# EAGLE design dspic33ch-revb (EAGLE 9.6.1)
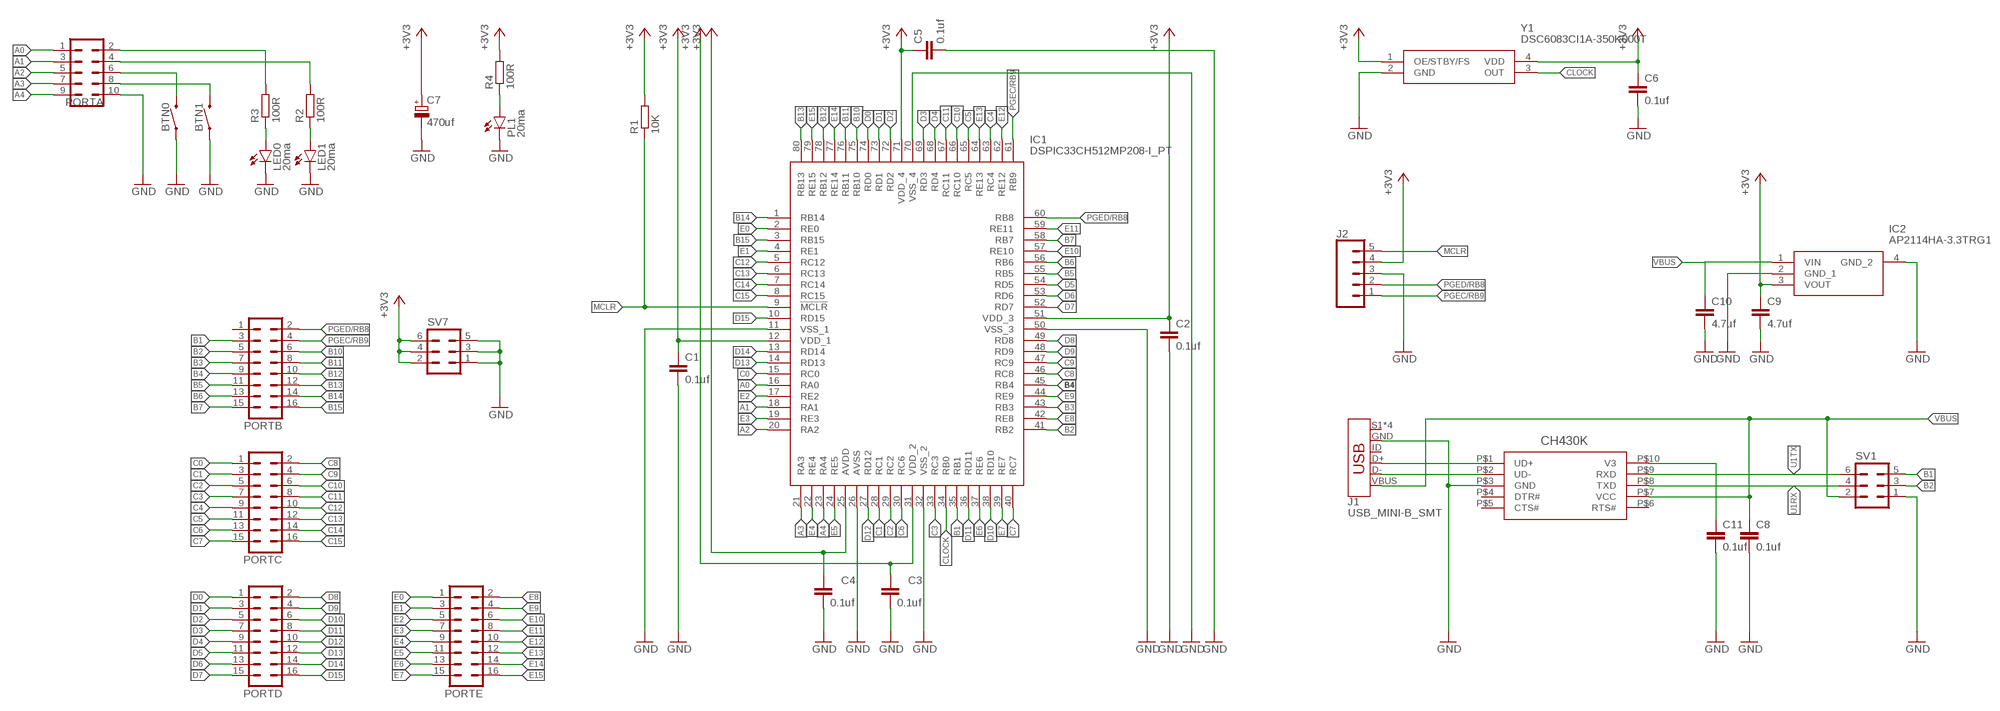
[diagram p0: schematic, sheet 1]

## Parts
BTN0  MOMENTARY-SWITCH-SPST-SMD-6.0X3.5MM  [TACTILE_SWITCH_SMD_6.0X3.5MM]
BTN1  MOMENTARY-SWITCH-SPST-SMD-6.0X3.5MM  [TACTILE_SWITCH_SMD_6.0X3.5MM]
C1  0.1uf  C-EUC0805  [C0805]
C2  0.1uf  C-EUC0805  [C0805]
C3  0.1uf  C-EUC0805  [C0805]
C4  0.1uf  C-EUC0805  [C0805]
C5  0.1uf  C-EUC0805  [C0805]
C6  0.1uf  C-EUC0805  [C0805]
C7  470uf  CPOL-EUE3.5-8  [E3,5-8]
C8  0.1uf  C-EUC0805  [C0805]
C9  4.7uf  C-EUC0805  [C0805]
C10  4.7uf  C-EUC0805  [C0805]
C11  0.1uf  C-EUC0805  [C0805]
IC1  DSPIC33CH512MP208-I_PT  [QFP50P1400X1400X120-80N]
IC2  AP2114HA-3.3TRG1  [SOT230P700X180-4N]
J1  USB_MINI-B_SMT  [USB-MINIB]
J2  CONN_05  [1X05]
LED0  20ma  LEDSML0805  [SML0805]
LED1  20ma  LEDSML0805  [SML0805]
PL1  20ma  LEDSML0805  [SML0805]
PORTA  MA05-2  [MA05-2]
PORTB  MA08-2  [MA08-2]
PORTC  MA08-2  [MA08-2]
PORTD  MA08-2  [MA08-2]
PORTE  MA08-2  [MA08-2]
R1  10K  R-EU_R0805  [R0805]
R2  100R  R-EU_R0805  [R0805]
R3  100R  R-EU_R0805  [R0805]
R4  100R  R-EU_R0805  [R0805]
SV1  MA03-2  [MA03-2]
SV7  MA03-2  [MA03-2]
U$1  CH430K  [ESSOP-10]
Y1  DSC6083CI1A-350K000T  [DSC6083CI1A350K000T]

## Nets
+3V3: C1.1 C2.1 C3.1 C4.1 C5.1 C6.1 C7.+ C9.1 IC1.12(VDD_1) IC1.25(AVDD) IC1.31(VDD_2) IC1.51(VDD_3) IC1.71(VDD_4) IC2.3(VOUT) J2.4 R1.2 R4.2 SV7.2 SV7.4 SV7.6 Y1.1(OE/STBY/FS) Y1.4(VDD)
A0: IC1.16(RA0) PORTA.1
A1: IC1.18(RA1) PORTA.3
A2: IC1.20(RA2) PORTA.5
A3: IC1.21(RA3) PORTA.7
A4: IC1.23(RA4) PORTA.9
B1: IC1.35(RB1) PORTB.3 SV1.5
B2: IC1.41(RB2) PORTB.5 SV1.3
B3: IC1.43(RB3) PORTB.7
B4: IC1.45(RB4) PORTB.9
B5: IC1.55(RB5) PORTB.11
B6: IC1.56(RB6) PORTB.13
B7: IC1.58(RB7) PORTB.15
B10: IC1.75(RB10) PORTB.6
B11: IC1.76(RB11) PORTB.8
B12: IC1.78(RB12) PORTB.10
B13: IC1.80(RB13) PORTB.12
B14: IC1.1(RB14) PORTB.14
B15: IC1.3(RB15) PORTB.16
C0: IC1.15(RC0) PORTC.1
C1: IC1.28(RC1) PORTC.3
C2: IC1.29(RC2) PORTC.5
C3: IC1.33(RC3) PORTC.7
C4: IC1.63(RC4) PORTC.9
C5: IC1.65(RC5) PORTC.11
C6: IC1.30(RC6) PORTC.13
C7: IC1.40(RC7) PORTC.15
C8: IC1.46(RC8) PORTC.2
C9: IC1.47(RC9) PORTC.4
C10: IC1.66(RC10) PORTC.6
C11: IC1.67(RC11) PORTC.8
C12: IC1.5(RC12) PORTC.10
C13: IC1.6(RC13) PORTC.12
C14: IC1.7(RC14) PORTC.14
C15: IC1.8(RC15) PORTC.16
CLOCK [logic]: IC1.34(RB0) Y1.3(OUT)
D0: IC1.74(RD0) PORTD.1
D1: IC1.73(RD1) PORTD.3
D2: IC1.72(RD2) PORTD.5
D3: IC1.69(RD3) PORTD.7
D4: IC1.68(RD4) PORTD.9
D5: IC1.54(RD5) PORTD.11
D6: IC1.53(RD6) PORTD.13
D7: IC1.52(RD7) PORTD.15
D8: IC1.49(RD8) PORTD.2
D9: IC1.48(RD9) PORTD.4
D10: IC1.38(RD10) PORTD.6
D11: IC1.36(RD11) PORTD.8
D12: IC1.27(RD12) PORTD.10
D13: IC1.14(RD13) PORTD.12
D14: IC1.13(RD14) PORTD.14
D15: IC1.10(RD15) PORTD.16
E0: IC1.2(RE0) PORTE.1
E1: IC1.4(RE1) PORTE.3
E2: IC1.17(RE2) PORTE.5
E3: IC1.19(RE3) PORTE.7
E4: IC1.22(RE4) PORTE.9
E5: IC1.24(RE5) PORTE.11
E6: IC1.37(RE6) PORTE.13
E7: IC1.39(RE7) PORTE.15
E8: IC1.42(RE8) PORTE.2
E9: IC1.44(RE9) PORTE.4
E10: IC1.57(RE10) PORTE.6
E11: IC1.59(RE11) PORTE.8
E12: IC1.62(RE12) PORTE.10
E13: IC1.64(RE13) PORTE.12
E14: IC1.77(RE14) PORTE.14
E15: IC1.79(RE15) PORTE.16
GND: BTN0.1 BTN1.1 C1.2 C2.2 C3.2 C4.2 C5.2 C6.2 C7.- C8.2 C9.2 C10.2 C11.2 IC1.11(VSS_1) IC1.26(AVSS) IC1.32(VSS_2) IC1.50(VSS_3) IC1.70(VSS_4) IC2.2(GND_1) IC2.4(GND_2) J1.GND J2.3 LED0.C LED1.C PL1.C PORTA.10 SV1.1 SV7.1 SV7.3 SV7.5 U$1.P$3(GND) Y1.2(GND)
MCLR [logic]: IC1.9(!MCLR) J2.5 R1.1
N$1 [logic]: LED1.A R2.1
N$2: PORTA.2 R3.2
N$3: PORTA.4 R2.2
N$4 [logic]: LED0.A R3.1
N$5: BTN0.2 PORTA.6
N$6 [logic]: PL1.A R4.1
N$8: BTN1.2 PORTA.8
N$9: C11.1 U$1.P$10(V3)
PGEC/RB9 [logic]: IC1.61(RB9) J2.1 PORTB.4
PGED/RB8 [logic]: IC1.60(RB8) J2.2 PORTB.2
U1RX: SV1.4 U$1.P$8(TXD)
U1TX: SV1.6 U$1.P$9(RXD)
USB_N: J1.D- U$1.P$2(UD-)
USB_P: J1.D+ U$1.P$1(UD+)
VBUS [power]: C8.1 C10.1 IC2.1(VIN) J1.VBUS SV1.2 U$1.P$7(VCC)
Unconnected: J1.ID J1.S1(SHIELD) J1.S2(SHIELD) J1.S3(SHIELD) J1.S4(SHIELD) PORTB.1 U$1.P$4(DTR#) U$1.P$5(CTS#) U$1.P$6(RTS#)

## Library data of the parts
BTN0 BTN1 = SparkFun-Switches:MOMENTARY-SWITCH-SPST: Momentary Switch (Pushbutton) - SPST Normally-open (NO) SPST momentary switches (buttons, pushbuttons). Variants PTH-12MM - 12mm square, through-hole Momentary Pushbutton Switch - 12mm Square <https://www.sparkfun.com/products/9190> (COM-09190) PTH-6.0MM, PTH-6.0MM-KIT - 6.0mm square, through-hole Mini Pushbutton Switch <https://www.sparkfun.com/products/97> (COM-00097) KIT package intended for soldering kit's - only one side of pads' copper is exposed. PTH-RIGHT-ANGLE-KIT - Right-angle, through-hole Right Angle Tactile Button <https://www.sparkfun.com/products/10791> - Used on SparkFun BigTime Watch Kit <https://www.sparkfun.com/products/11734> SMD-12MM - 12mm square, surface-mount Tactile Button - SMD (12mm) <https://www.sparkfun.com/products/12993> (COM-12993) Used on SparkFun PicoBoard <https://www.sparkfun.com/products/11888> SMD-4.5MM - 4.5mm Square Trackball Switch Used on SparkFun Blackberry Trackballer Breakout <https://www.sparkfun.com/products/13169> SMD-4.6MMX2.8MM - 4.60mm x 2.80mm, surface mount Used on SparkFun SAMD21 Mini Breakout <https://www.sparkfun.com/products/13664> SMD-5.2MM, SMD-5.2-REDUNDANT - 5.2mm square, surface-mount Mini Pushbutton Switch - SMD <https://www.sparkfun.com/products/8720> (COM-08720) Used on Arduino Pro Mini <https://www.sparkfun.com/products/11114> REDUNDANT package connects both switch circuits together SMD-6.0X3.5MM - 6.0 x 3.5mm, surface mount Momentary Reset Switch SMD <https://www.sparkfun.com/products/8229> (COM-08229) SMD-6.2MM-TALL - 6.2mm square, surface mount Tactile Button - SMD (6mm) <https://www.sparkfun.com/products/12992> Used on SparkFun Digital Sandbox <https://www.sparkfun.com/products/12651> SMD-RIGHT-ANGLE - Right-angle, surface mount Used on SparkFun Block for Intel® Edison - Arduino <https://www.sparkfun.com/products/13036>; PROD_ID: SWCH-14278; SF_SKU: COM-08229
C1-C6 C8-C11 = rcl:C-EU: CAPACITOR, European symbol; SPICEPREFIX: C
C7 = rcl:CPOL-EU: POLARIZED CAPACITOR, European symbol; SPICEPREFIX: C
IC1 = DSPIC33CH512MP208-I_PT:DSPIC33CH512MP208-I_PT: MCU 16-bit dsPIC RISC 512KB Flash 3.3V 80-Pin TQFP Tray Source: Datasheet <https://componentsearchengine.com/Datasheets/1/dsPIC33CH512MP208-I_PT.pdf>; ARROW_PART_NUMBER: DSPIC33CH512MP208-I/PT; ARROW_PRICE-STOCK: https://www.arrow.com/en/products/dspic33ch512mp208-ipt/microchip-technology; DESCRIPTION: MCU 16-bit dsPIC RISC 512KB Flash 3.3V 80-Pin TQFP Tray; HEIGHT: 1.2mm; MANUFACTURER_NAME: Microchip; MANUFACTURER_PART_NUMBER: DSPIC33CH512MP208-I/PT; MOUSER_PART_NUMBER: 579-33CH512MP208IPT; MOUSER_PRICE-STOCK: https://www.mouser.co.uk/ProductDetail/Microchip-Technology/dsPIC33CH512MP208-I-PT?qs=PqoDHHvF64%2FoRuzaf3bx2A%3D%3D
IC2 = AP2114HA-3.3TRG1:AP2114HA-3.3TRG1: Linear Voltage Regulator IC Positive Fixed 1 Output 1A SOT-223-3 Source: Datasheet <https://www.diodes.com//assets/Datasheets/AP2114.pdf>; ARROW_PART_NUMBER: AP2114HA-3.3TRG1; ARROW_PRICE-STOCK: https://www.arrow.com/en/products/ap2114ha-3.3trg1/diodes-incorporated?region=asia; DESCRIPTION: Linear Voltage Regulator IC Positive Fixed 1 Output 1A SOT-223-3; HEIGHT: 1.8mm; MANUFACTURER_NAME: Diodes Incorporated; MANUFACTURER_PART_NUMBER: AP2114HA-3.3TRG1; MOUSER_PART_NUMBER: 621-AP2114HA-3.3TRG1; MOUSER_PRICE-STOCK: https://www.mouser.co.uk/ProductDetail/Diodes-Incorporated/AP2114HA-3.3TRG1?qs=M%2FOdCRO8QQ3KWhA9Gt6VoQ%3D%3D
J1 = SparkFun-Connectors:USB_MINI-B: USB type Mini-B Connector Breaks out 5th pin, and includes shield pins if needed. SparkFun Products: SparkFun FTDI Basic Breakout <https://www.sparkfun.com/products/9716> SparkFun XBee Explorer USB <https://www.sparkfun.com/products/11812> SparkFun Redboard <https://www.sparkfun.com/products/12757>; PROD_ID: CONN-08193; SF_ID: PRT-00587
J2 = SparkFun-Connectors:CONN_05: Multi connection point. Often used as Generic Header-pin footprint for 0.1 inch spaced/style header connections On any of the 0.1 inch spaced packages, you can populate with these: Break Away Headers - Straight <https://www.sparkfun.com/products/116> (PRT-00116) Break Away Male Headers - Right Angle <https://www.sparkfun.com/products/553> (PRT-00553) Female Headers <https://www.sparkfun.com/products/115> (PRT-00115) Break Away Headers - Machine Pin <https://www.sparkfun.com/products/117> (PRT-00117) Break Away Female Headers - Swiss Machine Pin <https://www.sparkfun.com/products/743> (PRT-00743) For SCREWTERMINALS and SPRING TERMINALS visit here: Screw Terimnals on SparkFun.com <https://www.sparkfun.com/search/results?term=Screw+Terminals> (5mm/3.5mm/2.54mm spacing) This device is also useful as a general connection point to wire up your design to another part of your project. Our various solder wires solder well into these plated through hole pads. Hook-Up Wire - Assortment (Stranded, 22 AWG) <https://www.sparkfun.com/products/11375> (PRT-11375) Hook-Up Wire - Assortment (Solid Core, 22 AWG) <https://www.sparkfun.com/products/11367> (PRT-11367) View the entire wire category on our website here <https://www.sparkfun.com/categories/141> Special notes: Molex polarized connector foot print use with SKU : PRT-08231 with associated crimp pins and housings. 1MM SMD Version SKU: PRT-10208
LED0 LED1 PL1 = led:LED: LED OSRAM: - CHIPLED LG R971, LG N971, LY N971, LG Q971, LY Q971, LO R971, LY R971 LH N974, LH R974 LS Q976, LO Q976, LY Q976 LO Q996 - Hyper CHIPLED LW Q18S LB Q993, LB Q99A, LB R99A - SideLED LS A670, LO A670, LY A670, LG A670, LP A670 LB A673, LV A673, LT A673, LW A673 LH A674 LY A675 LS A676, LA A676, LO A676, LY A676, LW A676 LS A679, LY A679, LG A679 - Hyper Micro SIDELED® LS Y876, LA Y876, LO Y876, LY Y876 LT Y87S - SmartLED LW L88C, LW L88S LB L89C, LB L89S, LG L890 LS L89K, LO L89K, LY L89K LS L896, LA L896, LO L896, LY L896 - TOPLED LS T670, LO T670, LY T670, LG T670, LP T670 LSG T670, LSP T670, LSY T670, LOP T670, LYG T670 LG T671, LOG T671, LSG T671 LB T673, LV T673, LT T673, LW T673 LH T674 LS T676, LA T676, LO T676, LY T676, LB T676, LH T676, LSB T676, LW T676 LB T67C, LV T67C, LT T67C, LS T67K, LO T67K, LY T67K, LW E67C LS E67B, LA E67B, LO E67B, LY E67B, LB E67C, LV E67C, LT E67C LW T67C LS T679, LY T679, LG T679 LS T770, LO T770, LY T770, LG T770, LP T770 LB T773, LV T773, LT T773, LW T773 LH T774 LS E675, LA E675, LY E675, LS T675 LS T776, LA T776, LO T776, LY T776, LB T776 LHGB T686 LT T68C, LB T68C - Hyper Mini TOPLED® LB M676 - Mini TOPLED Santana® LG M470 LS M47K, LO M47K, LY M47K Source: http://www.osram.convergy.de LUXEON: - LUMILED® LXK2-PW12-R00, LXK2-PW12-S00, LXK2-PW14-U00, LXK2-PW14-V00 LXK2-PM12-R00, LXK2-PM12-S00, LXK2-PM14-U00 LXK2-PE12-Q00, LXK2-PE12-R00, LXK2-PE12-S00, LXK2-PE14-T00, LXK2-PE14-U00 LXK2-PB12-K00, LXK2-PB12-L00, LXK2-PB12-M00, LXK2-PB14-N00, LXK2-PB14-P00, LXK2-PB14-Q00 LXK2-PR12-L00, LXK2-PR12-M00, LXK2-PR14-Q00, LXK2-PR14-R00 LXK2-PD12-Q00, LXK2-PD12-R00, LXK2-PD12-S00 LXK2-PH12-R00, LXK2-PH12-S00 LXK2-PL12-P00, LXK2-PL12-Q00, LXK2-PL12-R00 Source: www.luxeon.com KINGBRIGHT: KA-3528ASYC Source: www.kingbright.com
PORTA = angelo-con-lstb:MA05-2: PIN HEADER; OC_FARNELL: unknown; OC_NEWARK: unknown
PORTB PORTC PORTD PORTE = angelo-con-lstb:MA08-2: PIN HEADER; OC_FARNELL: unknown; OC_NEWARK: unknown
R1-R4 = rcl:R-EU_: RESISTOR, European symbol; SPICEPREFIX: R
SV1 SV7 = con-lstb:MA03-2: PIN HEADER; OC_FARNELL: unknown; OC_NEWARK: unknown
U$1 = ch340k-nopad:CH430K: CH340K usb - uart
Y1 = angelo-DSC6083CI1A-350K000T:DSC6083CI1A-350K000T: Standard Clock Oscillators MEMS Oscillator, Ultra Low Power, LVCMOS, -40C-85C, 50ppm, 3.2x2.5mm Source: Datasheet <http://ww1.microchip.com/downloads/en/DeviceDoc/DSC60XX-Ultra-Small-Ultra-Low-Power-MEMS-Oscillator-DS20005625C.pdf>; ARROW_PART_NUMBER: DSC6083CI1A-350K000T; ARROW_PRICE-STOCK: https://www.arrow.com/en/products/dsc6083ci1a-350k000t/microchip-technology; DESCRIPTION: Standard Clock Oscillators MEMS Oscillator, Ultra Low Power, LVCMOS, -40C-85C, 50ppm, 3.2x2.5mm; HEIGHT: 0.9mm; MANUFACTURER_NAME: Microchip; MANUFACTURER_PART_NUMBER: DSC6083CI1A-350K000T; MOUSER_PART_NUMBER: 579-DSC6083CI1A350K; MOUSER_PRICE-STOCK: https://www.mouser.com/Search/Refine.aspx?Keyword=579-DSC6083CI1A350K

## Net classes
0 default: width 0.152 mm, drill 0.254 mm, clearance 0.203 mm
1 logic: width 0.152 mm, drill 0.254 mm, clearance 0.152 mm
2 power: width 0.406 mm, drill 0.254 mm, clearance 0.203 mm

## Board
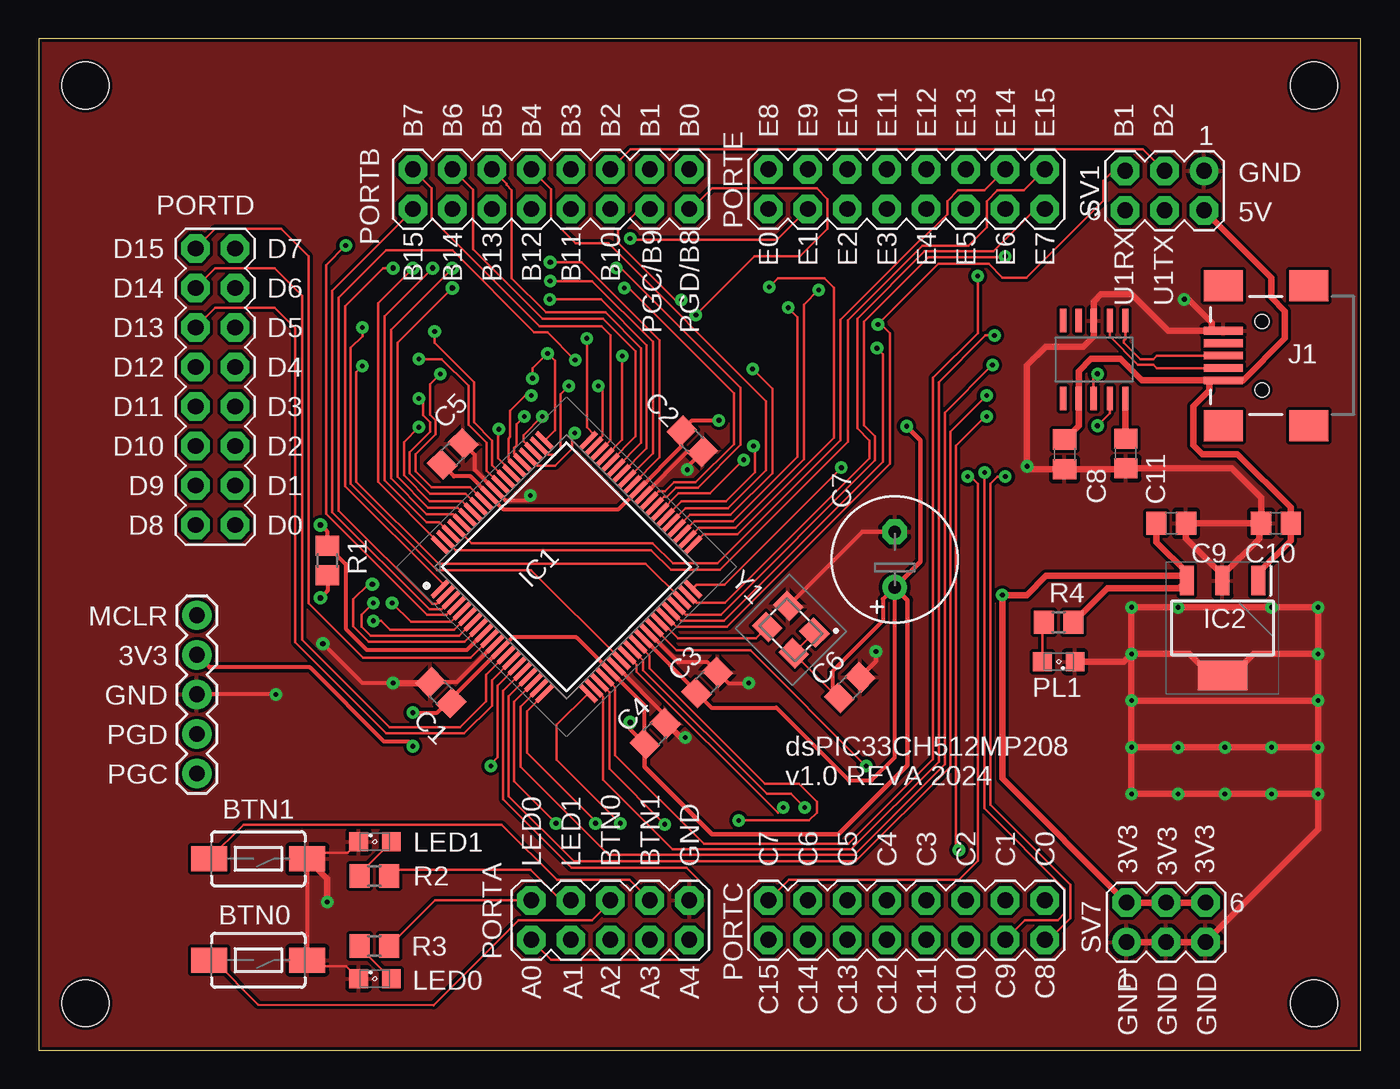
[diagram p1: board, top side]
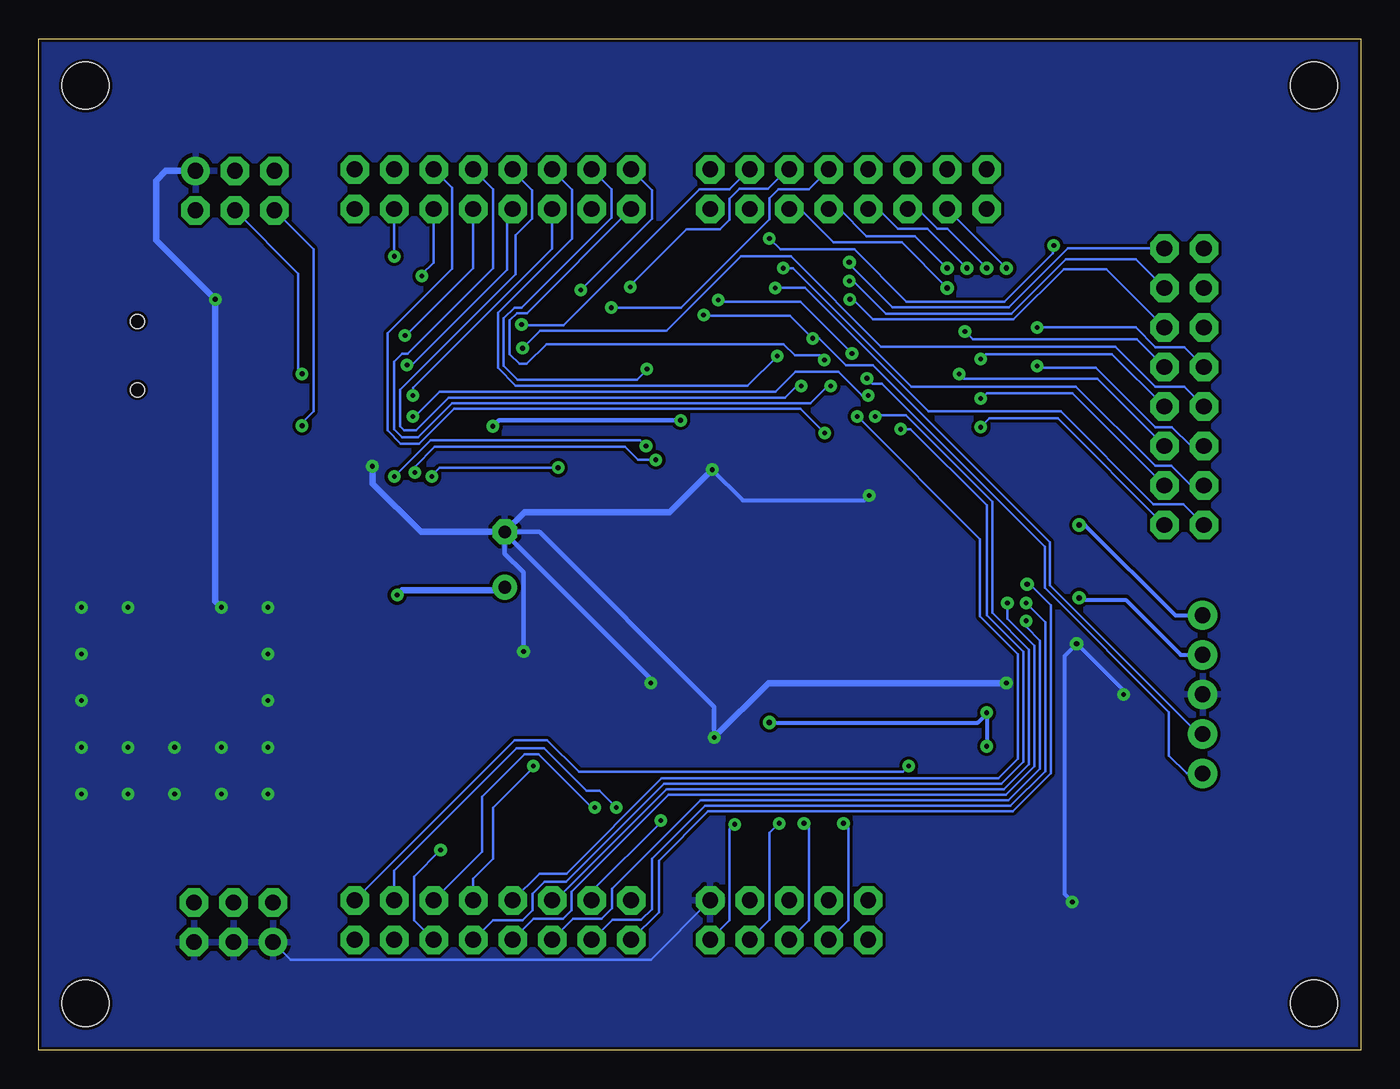
[diagram p2: board, bottom side, seen from below]

Size 85 x 65 mm. Coordinates in mm from the lower left corner, seen from the top.
Outline: 0,0 85,0 85,65 0,65 0,0
Copper layers (1*16): Top 0.035mm / dielectric 1.6mm / Bottom 0.035mm
Design rules "angelo-jlcpcb-2layers *": minimum track width 6mil, minimum drill 0.3mm, track to track 6mil, track to pad 6mil, pad to pad 6mil, via to via 10mil, smd to smd 6mil, copper to edge 0.2mm, drill to drill 8mil, minimum pad ring 10mil, minimum via ring 10mil, stop-mask expansion 4mil, vias tented up to drill 0mil, thermal gap 10mil
Holes 3 mm at 3,3 3,62 82,3 82,62

### Footprints (pad centres in the part's own frame; a part is rotated, then mirrored left to right if it is on the bottom)
TACTILE_SWITCH_SMD_6.0X3.5MM = smd 2.3 x 1.6: 1 -3.15,0; 2 3.15,0
C0805 = smd 1.3 x 1.5: 1 -0.95,0; 2 0.95,0
E3,5-8 = drill 0.813 pad 1.6: + -1.778,0 | drill 0.813 pad 1.6 octagon: - 1.778,0
QFP50P1400X1400X120-80N = smd 1.475 x 0.3: 1 -6.738,4.75; 2 -6.738,4.25; 3 -6.738,3.75; 4 -6.738,3.25; 5 -6.738,2.75; 6 -6.738,2.25; 7 -6.738,1.75; 8 -6.738,1.25; 9 -6.738,0.75; 10 -6.738,0.25; 11 -6.738,-0.25; 12 -6.738,-0.75; 13 -6.738,-1.25; 14 -6.738,-1.75; 15 -6.738,-2.25; 16 -6.738,-2.75; 17 -6.738,-3.25; 18 -6.738,-3.75; 19 -6.738,-4.25; 20 -6.738,-4.75; 41 6.738,-4.75; 42 6.738,-4.25; 43 6.738,-3.75; 44 6.738,-3.25; 45 6.738,-2.75; 46 6.738,-2.25; 47 6.738,-1.75; 48 6.738,-1.25; 49 6.738,-0.75; 50 6.738,-0.25; 51 6.738,0.25; 52 6.738,0.75; 53 6.738,1.25; 54 6.738,1.75; 55 6.738,2.25; 56 6.738,2.75; 57 6.738,3.25; 58 6.738,3.75; 59 6.738,4.25; 60 6.738,4.75 | smd 0.3 x 1.475: 21 -4.75,-6.738; 22 -4.25,-6.738; 23 -3.75,-6.738; 24 -3.25,-6.738; 25 -2.75,-6.738; 26 -2.25,-6.738; 27 -1.75,-6.738; 28 -1.25,-6.738; 29 -0.75,-6.738; 30 -0.25,-6.738; 31 0.25,-6.738; 32 0.75,-6.738; 33 1.25,-6.738; 34 1.75,-6.738; 35 2.25,-6.738; 36 2.75,-6.738; 37 3.25,-6.738; 38 3.75,-6.738; 39 4.25,-6.738; 40 4.75,-6.738; 61 4.75,6.738; 62 4.25,6.738; 63 3.75,6.738; 64 3.25,6.738; 65 2.75,6.738; 66 2.25,6.738; 67 1.75,6.738; 68 1.25,6.738; 69 0.75,6.738; 70 0.25,6.738; 71 -0.25,6.738; 72 -0.75,6.738; 73 -1.25,6.738; 74 -1.75,6.738; 75 -2.25,6.738; 76 -2.75,6.738; 77 -3.25,6.738; 78 -3.75,6.738; 79 -4.25,6.738; 80 -4.75,6.738
SOT230P700X180-4N = smd 1.9 x 0.9: 1 -3.05,2.3; 2 -3.05,0; 3 -3.05,-2.3 | smd 1.9 x 3.2: 4 3.05,0
USB-MINIB = smd 2.5 x 0.5: D+ 2.5,0; D- 2.5,0.8; GND 2.5,-1.6; ID 2.5,-0.8; VBUS 2.5,1.6 | smd 2.5 x 2: S1 -3,4.5; S2 2.5,4.5; S3 -3,-4.5; S4 2.5,-4.5 | hole 0.9: 0,2.2; 0,-2.2
1X05 = drill 1.016 pad 1.88: 1 0,0; 2 2.54,0; 3 5.08,0; 4 7.62,0; 5 10.16,0
SML0805 = smd 1.2 x 1.2: A 1.05,0; C -1.05,0
MA05-2 = drill 1.016 octagon: 1 -5.08,-1.27; 2 -5.08,1.27; 3 -2.54,-1.27; 4 -2.54,1.27; 5 0,-1.27; 6 0,1.27; 7 2.54,-1.27; 8 2.54,1.27; 9 5.08,-1.27; 10 5.08,1.27
MA08-2 = drill 1.016 octagon: 1 -8.89,-1.27; 2 -8.89,1.27; 3 -6.35,-1.27; 4 -6.35,1.27; 5 -3.81,-1.27; 6 -3.81,1.27; 7 -1.27,-1.27; 8 -1.27,1.27; 9 1.27,-1.27; 10 1.27,1.27; 11 3.81,-1.27; 12 3.81,1.27; 13 6.35,-1.27; 14 6.35,1.27; 15 8.89,-1.27; 16 8.89,1.27
R0805 = smd 1.3 x 1.5: 1 -0.95,0; 2 0.95,0
MA03-2 = drill 1.016: 1 -2.54,-1.27 | drill 1.016 octagon: 2 -2.54,1.27; 3 0,-1.27; 4 0,1.27; 5 2.54,-1.27; 6 2.54,1.27
ESSOP-10 = smd 1.5 x 0.4: P$1 -2.5,2; P$2 -2.5,1; P$3 -2.5,-0.032; P$4 -2.5,-1; P$5 -2.5,-2; P$6 2.5,-2; P$7 2.5,-1; P$8 2.5,-0.032; P$9 2.5,1; P$10 2.5,2
DSC6083CI1A350K000T = smd 1.5 x 1.3: 1 1.2,0.95; 2 -1.2,0.95; 3 -1.2,-0.95; 4 1.2,-0.95

### Placement (x,y rotation side)
BTN0  14.11,5.77 180 top
BTN1  14.11,12.29 180 top
C1  25.85,22.97 135 top
C2  42.01,39.14 315 top
C3  42.97,23.62 45 top
C4  39.63,20.34 45 top
C5  26.61,38.31 45 top
C6  52.14,23.3 45 top
C7  55.04,31.53 90 top
C8  65.96,38.29 270 top
C9  72.82,33.86 0 top
C10  79.55,33.86 180 top
C11  69.9,38.35 270 top
IC1  33.93,31.06 45 top
IC2  76.12,27.13 270 top
J1  78.66,44.64 180 top
J2  10.16,17.78 90 top
LED0  21.61,4.58 0 top
LED1  21.61,13.39 0 top
PL1  65.58,24.95 180 top
PORTA  36.75,8.35 0 top
PORTB  32.94,55.34 180 top
PORTC  55.8,8.35 180 top
PORTD  11.35,42.64 90 top
PORTE  55.8,55.34 0 top
R1  18.56,31.46 270 top
R2  21.58,11.19 0 top
R3  21.58,6.68 0 top
R4  65.58,27.5 0 top
SV1  72.39,55.24 180 top
SV7  72.48,8.21 0 top
U$1  67.86,44.39 270 top
Y1  48.36,27.02 315 top

### Tracks (layer width: path | path; a pad name or v marks a point on that pad's centre or on a via)
+3V3  (via drill 0.3 pad 0.6, 0.35)
  Top 0.152: C6.1 51.41,22.63 Y1.4 Y1.1 | 18.11,29.09 v18.11,29.07
  Top 0.254: C5.1 26.7,36.88 27.75,36.88 IC1.71 29.86,34.77 37.28,34.77 IC1.51 41.34,38.82 C2.1 42.01,40.48 v43.73,40.48 | 26.52,22.59 IC1.12 30.46,26.52 34.57,26.52 IC1.25 38.91,22.19 38.91,19.73 C4.1 38.02,20.61 v38.02,21.05 | 26.52,22.59 C1.1 | IC1.31 42.3,23.04 C3.1 43.24,22 47.42,22 52.09,17.34 53.55,17.34 55.04,18.83 C7.+ 54.28,28.99 54.28,27.59 51.04,24.35 51.04,23.06 | v24.05,21.68 25.62,21.68 26.52,22.59 | v24.05,19.53 23.73,19.84 22.18,19.84 17.43,24.59 10.97,24.59 J2.4 | R1.2 18.55,29.52 18.11,29.09
  Top 0.305: C4.1 38.96,18.2 43.29,13.87 51.42,13.87 55.86,18.32 55.86,28.92 C7.+ 56.69,31.4 56.69,39.21 v55.8,40.1 | 51.04,23.06 C6.1
  Top 0.406: C9.1 71.87,32.65 73.82,30.7 IC2.3 | IC2.3 73.31,29.67 68.71,29.67 R4.2 | IC2.3 73.52,30.48 64.77,30.48 63.53,29.24 v61.96,29.24 61.96,17.46 SV7.2 SV7.4 SV7.6
  Bottom 0.152: v18.11,29.07 17.98,28.94
  Bottom 0.254: v24.05,21.68 24.05,21.62 | 24.05,21.62 v24.05,19.53 | v38.02,21.05 24.62,21.05 24.05,21.62 | 17.98,28.94 15.11,28.94 11.57,25.4 J2.4
  Bottom 0.305: v43.73,40.48 55.42,40.48 v55.8,40.1
  Bottom 0.406: C7.+ 55.23,29.56 61.64,29.56 v61.96,29.24
A0
  Top 0.152: IC1.16 29.84,23.08 29.84,16.11 34.24,11.72 41.64,11.72 43.1,10.26 43.1,6.45 42.47,5.81 32.94,5.81 PORTA.1
A1  (via drill 0.3 pad 0.6)
  Top 0.152: IC1.18 30.55,22.38 30.55,17.28 v33.26,14.57
  Bottom 0.152: v33.26,14.57 32.95,14.27 32.95,8.36 32.95,8.34 PORTA.3
A2  (via drill 0.3 pad 0.6)
  Top 0.152: IC1.20 31.38,21.79 31.38,19.12 35.86,14.64 v35.8,14.57
  Bottom 0.152: v35.8,14.57 35.49,14.27 35.49,8.34 PORTA.5
A3  (via drill 0.3 pad 0.6)
  Top 0.152: IC1.21 33.3,20.9 33.3,18.66 v37.38,14.57
  Bottom 0.152: v37.38,14.57 38.01,13.95 38.01,8.36 PORTA.7
A4  (via drill 0.3 pad 0.6)
  Top 0.152: IC1.23 36.69,22.99 36.69,18.07 v40.24,14.51
  Bottom 0.152: v40.24,14.51 40.57,14.18 40.57,8.34 PORTA.9
B1  (via drill 0.3 pad 0.6)
  Top 0.152: IC1.35 40.35,27.88 41.02,27.21 44.24,27.21 54.72,37.69 54.72,46.07 54.15,46.64 v53.96,46.64 57.86,50.55 61.09,50.55 61.98,49.66 63.5,49.66 68.45,54.61 68.45,55.88 69.09,56.52 SV1.5
  Bottom 0.152: v53.96,46.64 53.91,46.59 51.25,46.59 42.52,55.33 40.57,55.33 PORTB.3
B2  (via drill 0.3 pad 0.6)
  Top 0.152: IC1.41 42.75,33.16 44.94,33.16 51.14,39.36 51.14,48.99 50.53,49.6 47.52,49.6 v46.97,49.05 | PORTB.5 38.05,57.91 70.99,57.91 SV1.3
  Bottom 0.152: v46.97,49.05 46.97,49.12 43.34,52.75 41.21,52.75 40.57,53.38 40.57,54.73 39.95,55.35 38.1,55.35 36.84,56.61 PORTB.5
B3  (via drill 0.3 pad 0.6)
  Top 0.152: IC1.43 42.17,33.99 44.64,33.99 48.79,38.14 48.79,47.11 v48.18,47.72
  Bottom 0.152: v48.18,47.72 43.7,47.72 38.01,53.41 38.01,54.76 37.44,55.33 35.49,55.33 PORTB.7
B4
  Top 0.152: IC1.45 41.59,34.83 44.32,34.83 46.76,37.27 46.76,41.71 36.62,51.85 34.53,51.85 32.94,53.44 32.94,55.34 PORTB.9
B5
  Top 0.152: IC1.55 38.73,39.04 38.73,45.12 36.44,47.41 32.61,47.41 30.41,49.61 30.41,55.27 30.07,55.62 30.07,55.67 PORTB.11
B6
  Top 0.152: IC1.56 36.75,37.83 38.38,39.46 38.38,44.91 36.29,46.99 32.39,46.99 27.91,51.47 27.91,55.29 PORTB.13
B7
  Top 0.152: IC1.58 36.77,39.2 36.77,45.95 36.18,46.54 32.21,46.54 25.27,53.48 25.27,55.39 PORTB.15
B10  (via drill 0.35)
  Top 0.152: IC1.75 26.94,34.86 25.03,34.86 23.06,36.84 23.06,45.46 v26.59,48.99
  Bottom 0.152: v26.59,48.99 29.51,51.91 33.9,51.91 36.06,54.07 PORTB.6
B11  (via drill 0.35)
  Top 0.152: IC1.76 26.65,34.45 24.93,34.45 22.64,36.74 22.64,46.31 v26.59,50.26
  Bottom 0.152: v26.59,50.26 28.65,52.32 31.77,52.32 33.52,54.07 PORTB.8
B12  (via drill 0.35)
  Top 0.152: IC1.78 25.75,33.93 24.93,33.93 22.22,36.63 22.22,47.16 v25.32,50.26
  Bottom 0.152: v25.32,50.26 27.85,52.79 29.76,52.79 31.05,54.07 PORTB.10
B13  (via drill 0.35)
  Top 0.152: IC1.80 25.8,32.53 21.8,36.53 21.8,48.01 v24.05,50.26
  Bottom 0.152: v24.05,50.26 26.58,52.79 27.22,52.79 28.5,54.07 PORTB.12
B14  (via drill 0.35)
  Top 0.152: v22.78,50.26 22.14,50.26 19.71,47.82 19.71,36.25 25.95,30.01 25.95,29.79 IC1.1
  Bottom 0.152: PORTB.14 v22.78,50.26
B15
  Top 0.152: IC1.3 25.89,28.32 25.13,28.32 18.87,34.58 18.87,48.83 24.05,54.01 PORTB.16
C0  (via drill 0.3 pad 0.6)
  Top 0.152: IC1.15 29.49,23.43 29.49,18.81 29.07,18.39 v29.07,18.26
  Bottom 0.152: v29.07,18.26 29.45,17.88 50.28,17.88 52.31,19.91 54.4,19.91 PORTC.1
C1  (via drill 0.3 pad 0.6)
  Top 0.152: v47.86,15.59 47.52,15.25 38.44,24.33 38.44,24.77 IC1.28
  Bottom 0.152: v47.86,15.59 48.94,16.67 49.77,16.67 52.5,19.4 54.28,19.4 62.15,11.53 PORTC.3
C2  (via drill 0.3 pad 0.6)
  Top 0.152: v49.26,15.59 48.37,16.48 46.81,16.48 38.86,24.43 38.86,25.06 IC1.29
  Bottom 0.152: v49.26,15.59 49.43,15.59 52.86,19.02 53.77,19.02 56.5,16.29 56.5,12.73 PORTC.5
C3  (via drill 0.3 pad 0.6)
  Top 0.152: IC1.33 39.58,27.11 41,25.69 45.77,25.69 v53.2,18.26
  Bottom 0.152: v53.2,18.26 53.2,18.19 55.8,15.59 55.8,12.29 57.07,11.02 PORTC.7
C4  (via drill 0.3 pad 0.6)
  Top 0.152: v32.37,40.73 31.16,39.53 31.16,39.13 IC1.63
  Bottom 0.152: v32.37,40.73 24.47,32.84 24.47,27.87 22.05,25.45 22.05,18.73 23.31,17.47 44.95,17.47 51.08,11.34 52.82,11.34 PORTC.9
C5  (via drill 0.3 pad 0.6)
  Top 0.152: v31.23,40.73 30.73,40.24 30.73,38.89 30.55,38.71 30.55,38.32 IC1.65
  Bottom 0.152: v31.23,40.73 31.16,40.8 29.26,40.8 23.69,35.24 23.69,28.1 21.34,25.74 21.34,18.37 22.95,16.76 44.65,16.76 51.79,9.62 PORTC.11
C6  (via drill 0.3 pad 0.6)
  Top 0.152: IC1.30 39.28,25.35 39.28,24.53 46.69,17.11 48.88,17.11 50.02,15.97 50.02,15.25 49.53,14.76 v45.01,14.76
  Bottom 0.152: v45.01,14.76 45.01,14.64 49.45,10.19 PORTC.13
C7  (via drill 0.3 pad 0.6)
  Top 0.152: IC1.40 42.31,29.9 44.08,29.9 v51.61,37.43 | v59.74,36.86 59.93,36.86 60.37,36.42 60.37,12.16 59.17,10.95 48.24,10.95 PORTC.15
  Bottom 0.152: v51.61,37.43 59.23,37.43 59.77,36.89 v59.74,36.86
C8  (via drill 0.3 pad 0.6)
  Top 0.152: IC1.46 41.33,35.27 44.18,35.27 46.06,37.15 46.06,38.73 v45.96,38.83 | v62.15,36.86 61.64,36.86 61.2,36.42 61.2,15.78 66.34,10.64 66.34,8.48 64.94,7.08 PORTC.2
  Bottom 0.152: v62.15,36.86 59.8,39.21 46.34,39.21 v45.96,38.83
C9  (via drill 0.3 pad 0.6)
  Top 0.152: IC1.47 41.13,35.78 43.16,35.78 45.26,37.88 45.26,37.94 v45.32,37.94 | v60.82,37.12 60.82,15.53 65.96,10.38 65.96,8.79 65.52,8.35 63.42,8.35 PORTC.4
  Bottom 0.152: v45.32,37.94 46.47,37.94 47.29,38.77 59.55,38.77 60.82,37.5 v60.82,37.12
C10  (via drill 0.3 pad 0.6)
  Top 0.152: v60.94,40.73 60.88,40.73 58.98,38.83 58.98,13.05 v59.17,12.86 | v31.67,42.08 31.31,42.08 30.31,41.08 30.31,39.41 30.2,39.31 30.2,37.97 IC1.66
  Bottom 0.152: v60.94,40.73 60.82,40.73 59.23,42.32 37.64,42.32 36.35,43.61 33.6,43.61 32.07,42.08 v31.67,42.08 | v59.17,12.86 60.88,11.14 60.88,8.35 PORTC.6
C11  (via drill 0.3 pad 0.6)
  Top 0.152: IC1.67 30.4,37.16 29.53,38.03 29.53,39.87 v29.57,39.91
  Bottom 0.152: v29.57,39.91 28.94,39.91 24.05,35.02 24.05,27.95 21.69,25.59 21.69,18.52 23.1,17.11 44.8,17.11 51.1,10.81 52.48,10.81 53.25,10.05 53.25,9 53.9,8.35 55.8,8.35 PORTC.8
C12  (via drill 0.3 pad 0.6)
  Top 0.152: IC1.5 26.51,27.53 23.92,27.53 v22.72,28.73
  Bottom 0.152: v22.72,28.73 22.72,27.71 20.98,25.98 20.98,18.23 22.8,16.4 44.5,16.4 50.73,10.17 50.73,9 51.3,8.43 53.18,8.43 PORTC.10
C13  (via drill 0.3 pad 0.6)
  Top 0.152: IC1.6 26.71,27.02 22.59,27.02 22.02,27.59 v21.51,27.59
  Bottom 0.152: v21.51,27.59 21.51,27.21 20.62,26.32 20.62,18.08 22.66,16.05 42.45,16.05 48.13,10.37 48.13,9.13 48.83,8.43 50.64,8.43 PORTC.12
C14  (via drill 0.3 pad 0.6)
  Top 0.152: IC1.7 27.04,26.64 21.32,26.64 20.75,27.21 20.75,27.97 v21.51,28.73
  Bottom 0.152: v21.51,28.73 20.27,27.49 20.27,17.93 22.51,15.69 42.17,15.69 45.58,12.29 45.58,9.05 46.26,8.36 48.1,8.36 49.39,7.08 PORTC.14
C15  (via drill 0.35)
  Top 0.152: IC1.8 27.36,26.26 21.2,26.26 20.21,27.24 20.21,28.96 21.19,29.94 v21.45,29.94
  Bottom 0.152: v21.45,29.94 21.26,29.94 19.91,28.6 19.91,17.78 22.36,15.34 41.96,15.34 45.13,12.16 45.13,8.86 PORTC.16
CLOCK
  Top 0.152: IC1.34 40.03,27.53 41.09,26.47 46.11,26.47 Y1.3
D0  (via drill 0.3)
  Top 0.152: IC1.74 27.23,35.28 25.13,35.28 23.48,36.94 23.48,39.08 v24.43,40.04
  Bottom 0.152: v24.43,40.04 23.86,40.61 19.48,40.61 PORTD.1
D1  (via drill 0.3)
  Top 0.152: IC1.73 27.45,35.76 25.17,35.76 23.85,37.08 23.85,38.41 25.16,39.73 25.16,40.34 24.71,40.8 24.71,41.6 v24.43,41.88
  Bottom 0.152: v24.43,41.88 24.37,41.88 24.03,42.22 18.55,42.22 PORTD.3
D2  (via drill 0.3)
  Top 0.152: v25.83,43.47 25.16,42.8 25.16,40.84 25.52,40.49 25.52,39.59 24.24,38.3 24.24,37.21 25.27,36.18 27.74,36.18 IC1.72
  Bottom 0.152: v25.83,43.47 25.51,43.15 16.94,43.15 PORTD.5
D3  (via drill 0.3)
  Top 0.152: IC1.69 28.8,37.24 28.8,39.03 27.63,40.2 27.63,42.7 25.91,44.42 v24.43,44.42
  Bottom 0.152: v24.43,44.42 24.11,44.74 15.99,44.74 PORTD.7
D4  (via drill 0.3)
  Top 0.152: v25.45,46.2 25.45,45.46 27.99,42.92 27.99,40.35 29.16,39.18 29.16,37.59 IC1.68
  Bottom 0.152: v25.45,46.2 24.94,45.69 14.4,45.69 PORTD.9
D5  (via drill 0.3 pad 0.6)
  Top 0.152: IC1.54 39.09,38.69 39.09,45.32 36.15,48.26 v32.84,48.26
  Bottom 0.152: v32.84,48.26 32.75,48.35 31.36,46.97 22.32,46.97 19.1,50.2 16.37,50.2 PORTD.11
D6  (via drill 0.3 pad 0.6)
  Top 0.152: IC1.53 39.48,38.38 39.48,45.52 35.56,49.43 v32.88,49.43
  Bottom 0.152: v32.88,49.43 32.62,49.43 30.53,47.34 22.46,47.34 18.97,50.83 14.46,50.83 PORTD.13
D7  (via drill 0.35)
  Top 0.152: IC1.52 39.92,38.11 39.92,45.62 34.91,50.64 v32.88,50.64
  Bottom 0.152: v32.88,50.64 32.88,50.51 30.11,47.74 22.62,47.74 18.84,51.53 PORTD.15
D8  (via drill 0.3 pad 0.6)
  Top 0.152: IC1.49 39.84,35.91 40.25,35.91 40.84,36.49 42.22,36.49 44.69,38.96 44.69,42.22 37.92,48.99 v37.64,48.99
  Bottom 0.152: v37.64,48.99 35.74,48.99 27.81,41.05 19.29,41.05 13.32,35.08 11.41,35.08 PORTD.2
D9  (via drill 0.3 pad 0.6)
  Top 0.152: IC1.48 40.19,35.55 40.4,35.55 40.98,36.14 42.38,36.14 45.13,38.89 45.13,42.58 37.38,50.32 37.19,50.32 v37.13,50.26
  Bottom 0.152: v37.13,50.26 36.5,50.26 28.88,42.64 18.31,42.64 13.22,37.55 12.19,37.55 10.93,36.29 PORTD.4
D10  (via drill 0.3 pad 0.6)
  Top 0.152: IC1.38 39.01,31.27 25.69,31.27 20.42,36.55 20.42,43.58 v20.81,43.97
  Bottom 0.152: v20.81,43.97 20.68,43.85 17.04,43.85 13.22,40.02 12.13,40.02 10.93,38.83 PORTD.6
D11  (via drill 0.3 pad 0.6)
  Top 0.152: IC1.36 41.28,27.59 44.05,27.59 54.28,37.81 54.28,44.74 v53.9,45.12
  Bottom 0.152: v53.9,45.12 52.78,46.23 44.63,46.23 39.85,51.02 36.65,51.02 30.84,45.22 15.77,45.22 13.19,42.64 11.35,42.64 PORTD.8
D12  (via drill 0.3 pad 0.6)
  Top 0.152: v20.81,46.45 20.81,45.88 20.06,45.13 20.06,36.4 25.61,30.85 31.66,30.85 IC1.27
  Bottom 0.152: v20.81,46.45 14.46,46.45 13.19,45.18 11.35,45.18 PORTD.10
D13
  Top 0.152: IC1.14 29.13,23.78 29.13,22.13 27.35,20.35 22.34,20.35 16.49,26.2 16.49,46.39 15.16,47.72 11.35,47.72 PORTD.12
D14
  Top 0.152: IC1.13 30.05,25.39 28.77,24.12 28.77,22.41 27.1,20.73 22.57,20.73 16.93,26.37 16.93,48.49 15.16,50.26 11.35,50.26 PORTD.14
D15
  Top 0.152: IC1.10 28.99,26.44 27.75,25.2 20.85,25.2 17.35,28.71 17.35,51.03 15.58,52.8 11.35,52.8 PORTD.16
E0  (via drill 0.3 pad 0.6)
  Top 0.152: IC1.2 26.16,29.27 25.57,28.68 25.27,28.68 19.29,34.67 19.29,48.35 22.34,51.4 26.59,51.4 31.86,46.13 32.7,46.13 v34.48,44.35
  Bottom 0.152: v34.48,44.35 34.78,44.65 36.38,44.65 37.11,45.38 52.36,45.38 53.64,44.1 54.09,44.1 54.72,44.74 54.72,46.92 54.26,47.38 53.6,47.38 PORTE.1
E1  (via drill 0.3 pad 0.6)
  Top 0.152: IC1.4 26.68,28.4 26.64,28.4 26.21,27.97 24.98,27.97 18.46,34.49 18.46,50.45 v19.73,51.72 | v38.02,52.16 38.02,52.1 47.48,52.1 PORTE.3
  Bottom 0.152: v19.73,51.72 19.8,51.66 19.8,51.21 22.91,48.1 29.19,48.1 32.56,51.46 37.32,51.46 v38.02,52.16
E2  (via drill 0.3 pad 0.6)
  Top 0.152: IC1.17 30.2,22.73 30.2,16.33 34.4,12.12 52.52,12.12 58.62,18.22 58.62,39.74 v60.94,42.07
  Bottom 0.152: v60.94,42.07 60.94,42.56 51.99,51.51 PORTE.5
E3  (via drill 0.3 pad 0.6)
  Top 0.152: IC1.19 30.96,22.08 30.96,18.2 36.62,12.54 52.43,12.54 58.26,18.37 58.26,40.98 v61.33,44.04
  Bottom 0.152: v61.33,44.04 61.01,44.04 54.89,50.16 54.89,53.71 PORTE.7
E4  (via drill 0.3 pad 0.6)
  Top 0.152: IC1.22 36.27,22.7 36.27,17.38 40.75,12.9 52.22,12.9 57.87,18.54 57.87,36.12 57.87,42.93 60.88,45.94 v61.45,45.94
  Bottom 0.152: v61.45,45.94 61.39,45.94 57.07,50.26 PORTE.9
E5  (via drill 0.3 pad 0.6)
  Top 0.152: IC1.24 37.07,23.32 37.07,18.95 42.77,13.25 52.08,13.25 57.5,18.68 57.5,43.23 60.37,46.09 v60.37,49.75
  Bottom 0.152: v60.37,49.75 60.37,49.86 59.61,50.62 PORTE.11
E6  (via drill 0.3 pad 0.6)
  Top 0.152: IC1.37 40.99,28.56 41.58,27.97 43.85,27.97 53.78,37.9 53.78,39.44 53.05,40.18 53.05,46.81 57.2,50.96 62.02,50.96 62.09,51.02 v62.15,51.02
  Bottom 0.152: v62.15,51.02 PORTE.13
E7
  Top 0.152: IC1.39 41.73,29.3 42.29,28.74 44.12,28.74 53.42,38.05 53.42,39.17 52.63,39.97 52.63,47.01 56.95,51.34 61.39,51.34 64.12,54.07 PORTE.15
E8  (via drill 0.3 pad 0.6)
  Top 0.152: IC1.42 42.46,33.58 44.79,33.58 49.2,37.98 49.2,47.91 v50.15,48.86
  Bottom 0.152: v50.15,48.86 45.58,53.44 45.58,55.28 PORTE.2
E9  (via drill 0.3 pad 0.6)
  Top 0.152: IC1.44 41.88,34.41 44.48,34.41 47.16,37.09 47.16,42.51 v45.89,43.78
  Bottom 0.152: v45.89,43.78 45.89,43.72 46.53,43.08 54.21,43.08 55.1,43.97 55.1,47.04 54.41,47.73 53.95,47.73 48.18,53.5 48.18,55.34 PORTE.4
E10  (via drill 0.3 pad 0.6)
  Top 0.152: IC1.57 37.51,39.24 v37.51,44.61
  Bottom 0.152: v37.51,44.61 39.42,42.7 54.34,42.7 55.48,43.85 55.48,47.4 50.72,52.16 50.72,55.31 51.99,56.58 PORTE.6
E11  (via drill 0.3 pad 0.6)
  Top 0.152: IC1.59 35.69,38.92 36.24,39.48 36.24,42.41 v35.98,42.68
  Bottom 0.152: v35.98,42.68 36.27,42.68 37,41.94 58.66,41.94 60.75,39.85 61.51,39.85 61.77,40.1 61.77,42.45 54.34,49.88 54.34,52.38 53.27,53.45 53.27,55.26 54.53,56.52 PORTE.8
E12  (via drill 0.3 pad 0.6)
  Top 0.152: IC1.62 32.2,38.83 32.76,38.27 33.18,38.27 33.56,38.65 33.56,42.17 v34.07,42.68
  Bottom 0.152: v34.07,42.68 34.27,42.68 35.37,41.59 58.44,41.59 60.63,39.4 61.64,39.4 62.15,39.91 62.15,44.25 61.63,44.77 61.29,44.77 55.8,50.26 55.8,55.34 PORTE.10
E13  (via drill 0.3 pad 0.6)
  Top 0.152: IC1.64 31.5,38.12 32.05,37.56 33.2,37.56 34.27,38.64 34.27,39.47 v34.46,39.66
  Bottom 0.152: v34.46,39.66 36.04,41.23 58.29,41.23 60.54,38.98 61.73,38.98 62.57,39.83 62.57,46.08 58.42,50.23 58.42,55.42 PORTE.12
E14
  Top 0.152: IC1.77 26.9,33.52 27.84,32.59 39.47,32.59 40.78,31.28 43.62,31.28 51.55,39.2 51.55,46.94 56.66,52.05 56.74,52.05 58.42,53.73 58.42,54.56 59.12,55.26 60.8,55.26 PORTE.14
E15
  Top 0.152: IC1.79 26.16,32.79 26.81,32.13 39.38,32.13 40.64,30.88 43.79,30.88 52.02,39.11 52.02,46.91 56.81,51.7 59.77,51.7 60.96,52.88 60.96,54.56 61.66,55.26 63.34,55.26 PORTE.16
GND  (via drill 0.3 pad 0.6, 0.35)
  Top 0.152: LED0.C 19.75,5.39 18.16,5.39 | 17.78,5.77 BTN0.1 | LED1.C 19.84,12.67 17.64,12.67 BTN1.1
  Top 0.254: C5.2 28.04,38.22 28.04,37.3 IC1.70 30,35.34 31.42,35.34 31.61,35.53 v31.61,35.66 | IC1.50 41.69,38.47 C2.2 41.7,37.49 v41.7,37.31 | IC1.11 26.87,23.64 C1.2 | IC1.26 40.31,21.5 40.31,21.05 C4.2 | IC1.32 41.12,24.92 43.01,24.92 C3.2 44.34,23.59 v45.64,23.59 | Y1.2 52.95,33.31 | v22.78,23.59 20.81,23.59 18.29,26.12 v18.26,26.12 | BTN1.1 17.26,6.29 17.78,5.77 18.16,5.39 | v15.24,22.86 J2.3
  Top 0.305: 52.95,33.31 C7.- | C6.2 53.83,24.99 v53.83,25.62
  Top 0.406: C1.2 25.12,23.59 v22.78,23.59 | v41.58,20.1 41.26,20.1 40.31,21.05 | C10.2 C9.2 73.77,32.91 76.12,30.56 IC2.2 76.12,30.53 78.47,32.88 78.47,33.73 C10.2 | C10.2 78.6,35.51 76.71,37.4 C11.2 69.83,37.34 C8.2 63.74,37.34 v63.55,37.53 63.55,44.01 64.75,45.21 67.17,45.21 67.83,45.88 U$1.P$3 67.83,48.1 68.31,48.58 70.28,48.58 72.63,46.23 75.89,46.23 75.91,46.24 J1.GND 75.65,46.24 75.43,46.47 75.43,46.75 73.91,48.26 v73.66,48.26 | PL1.C 69.77,24.95 v70.27,25.46 | v70.27,25.46 v70.27,28.46 v73.27,28.46 v79.27,28.46 v82.27,28.46 v82.27,25.46 | v82.27,25.46 78.13,25.46 76.75,24.08 IC2.4 75.36,24.08 73.98,25.46 v70.27,25.46 | v70.27,25.46 v70.27,22.46 | v70.27,22.46 v82.27,22.46 | v82.27,22.46 v82.27,25.46 | v82.27,22.46 v82.27,19.46 | v82.27,19.46 v79.27,19.46 v76.27,19.46 v73.27,19.46 v70.27,19.46 | v70.27,19.46 v70.27,22.46 | v70.27,19.46 v70.27,16.46 v73.27,16.46 v76.27,16.46 v79.27,16.46 v82.27,16.46 | v82.27,16.46 v82.27,19.46 | v82.27,16.46 82.27,14.18 SV7.5 SV7.3 SV7.1 | BTN1.1 18.54,11.01 v18.54,9.53
  Bottom 0.152: PORTA.10 45.64,5.81 68.82,5.81 SV7.1
  Bottom 0.254: v31.61,35.66 31.92,35.34 39.73,35.34 v41.7,37.31 | v18.54,9.53 19.05,10.03 19.05,25.32 v18.26,26.12 15.24,23.1 v15.24,22.86
  Bottom 0.305: v45.64,23.59 45.64,23.84 54.97,33.18 54.97,33.24 C7.- | C7.- 55.04,31.91 53.83,30.7 v53.83,25.62 | v41.58,20.1 41.58,22.07 52.82,33.31 C7.-
  Bottom 0.406: v22.78,23.59 38.08,23.59 v41.58,20.1 | v41.7,37.31 44.43,34.58 53.77,34.58 C7.- 60.44,33.31 63.55,36.42 v63.55,37.53 | v73.27,28.46 73.66,28.85 v73.66,48.26 77.47,52.07 77.47,55.88 76.83,56.52 SV1.1
  pour Bottom: 0,0 0,65 85,65 85,0
  pour Top (no thermals): 82.27,28.46 82.27,16.46 70.27,16.46 70.27,28.46
  pour Top (isolate 0.203): 0,0 0,65 85,65 85,0
MCLR  (via drill 0.35)
  Top 0.254: IC1.9 27.54,25.73 21.09,25.73 19.73,27.08 19.73,31.23 R1.1 18.55,33.3 v18.11,33.75
  Bottom 0.254: v18.11,33.75 17.73,33.75 11.91,27.94 J2.5
N$1
  Top 0.152: LED1.A 22.66,13.35 20.63,11.32 R2.1
N$2
  Top 0.152: R3.2 25.47,9.62 PORTA.2
N$3
  Top 0.152: R2.2 22.93,11.59 31.61,11.59 33.58,9.62 PORTA.4
N$4
  Top 0.152: R3.1 20.63,6.61 LED0.A
N$5
  Top 0.152: PORTA.6 36.75,9.51 35.57,8.33 30.84,8.33 25.4,2.89 14.11,2.92 11.26,5.77 BTN0.2
N$6
  Top 0.152: PL1.A 64.53,27.39 R4.1
N$8
  Top 0.152: BTN1.2 13.16,14.49 29.76,14.49 33.32,10.93 37.98,10.93 PORTA.8
N$9
  Top 0.406: U$1.P$10 69.86,39.34 C11.1
PGEC/RB9  (via drill 0.3 pad 0.6)
  Top 0.152: IC1.61 33.19,39.85 33.19,44.3 v32.71,44.78 31.75,43.82 v31.75,43.18 | v41.3,48.21 40.94,48.21 37.29,51.86 37.29,51.88 37.26,51.91 37.26,52.67 38.4,53.82 39.04,53.82 PORTB.4
  Bottom 0.152: v32.71,44.78 36.03,48.1 41.2,48.1 v41.3,48.21 | v31.75,43.18 31.39,42.82 30.77,42.82 20.32,32.36 20.32,29.72 12.32,21.72 12.32,18.92 11.18,17.78 J2.1
PGED/RB8  (via drill 0.3 pad 0.6)
  Top 0.152: v35.24,45.75 35.24,40.04 35.72,39.56 IC1.60 | v42.25,47.26 46.02,51.02 48.94,51.02 50.72,52.8 50.72,54.7 50.03,55.39 43.28,55.39 42.21,54.32 42.08,54.32 PORTB.2
  Bottom 0.152: v42.25,47.26 42.21,47.21 36.7,47.21 v35.24,45.75 34.84,45.75 33.1,44.02 31.37,44.02 19.99,32.63 19.99,29.88 10.43,20.32 J2.2
U1RX  (via drill 0.3 pad 0.6)
  Top 0.152: v68.07,43.47 67.82,43.22 67.82,41.9 U$1.P$8
  Bottom 0.152: v68.07,43.47 68.33,43.76 68.33,49.91 SV1.4
U1TX  (via drill 0.3 pad 0.6)
  Top 0.152: U$1.P$9 68.86,40.92 v68.07,40.13
  Bottom 0.152: v68.07,40.13 68.07,40.33 67.34,41.06 67.34,51.46 SV1.6
USB_N
  Top 0.152: J1.D- 71.88,43.84 71.66,44.06 70.68,44.06 68.86,45.88 U$1.P$2
USB_P
  Top 0.152: J1.D+ 71.9,44.64 71.68,44.42 70.83,44.42 69.78,45.47 69.78,45.61 69.86,45.7 U$1.P$1
VBUS
  Top 0.406: J1.VBUS 70.93,43.04 69.53,44.44 67.66,44.44 66.86,43.64 U$1.P$7 66.86,40.15 C8.1 | J1.VBUS 76.79,43.04 76.81,43.06 77.45,43.06 80.14,45.74 80.14,47.5 79.25,48.39 79.25,49.66 SV1.2 | IC2.1 78.42,30.67 80.5,32.75 C10.1 80.5,34.88 77.07,38.31 74.83,38.31 74.25,38.88 74.25,41.39 75.27,42.41 75.27,43.04 J1.VBUS

### Text on the board
tNames: B7 | B6 | B5 | B4 | B3 | B2 | B1 | B0 | E8 | E9 | E10 | E11 | E12 | E13 | E14 | E15 | B1 | B2 | GND | 5V | D15 | D7 | D14 | E0 | E1 | E2 | E3 | E4 | E5 | E6 | E7 | B15 | B14 | B13 | B12 | B11 | B10 | D6 | U1RX | U1TX | D13 | D5 | PGC/B9 | PGD/B8 | D12 | D4 | D11 | D3 | D10 | D2 | D9 | D1 | D8 | D0 | MCLR | 3V3 | GND | PGD | PGC | dsPIC33CH512MP208 / v1.0 REVA 2024 | 3V3 | 3V3 | 3V3 | LED0 | LED1 | BTN0 | BTN1 | GND | C7 | C6 | C5 | C4 | C3 | C2 | C1 | C0 | GND | GND | GND | A0 | A1 | A2 | A3 | A4 | C9 | C8 | C15 | C14 | C13 | C12 | C11 | C10